# EAGLE schematic Gen7AdapterBoard (EAGLE 6.3)
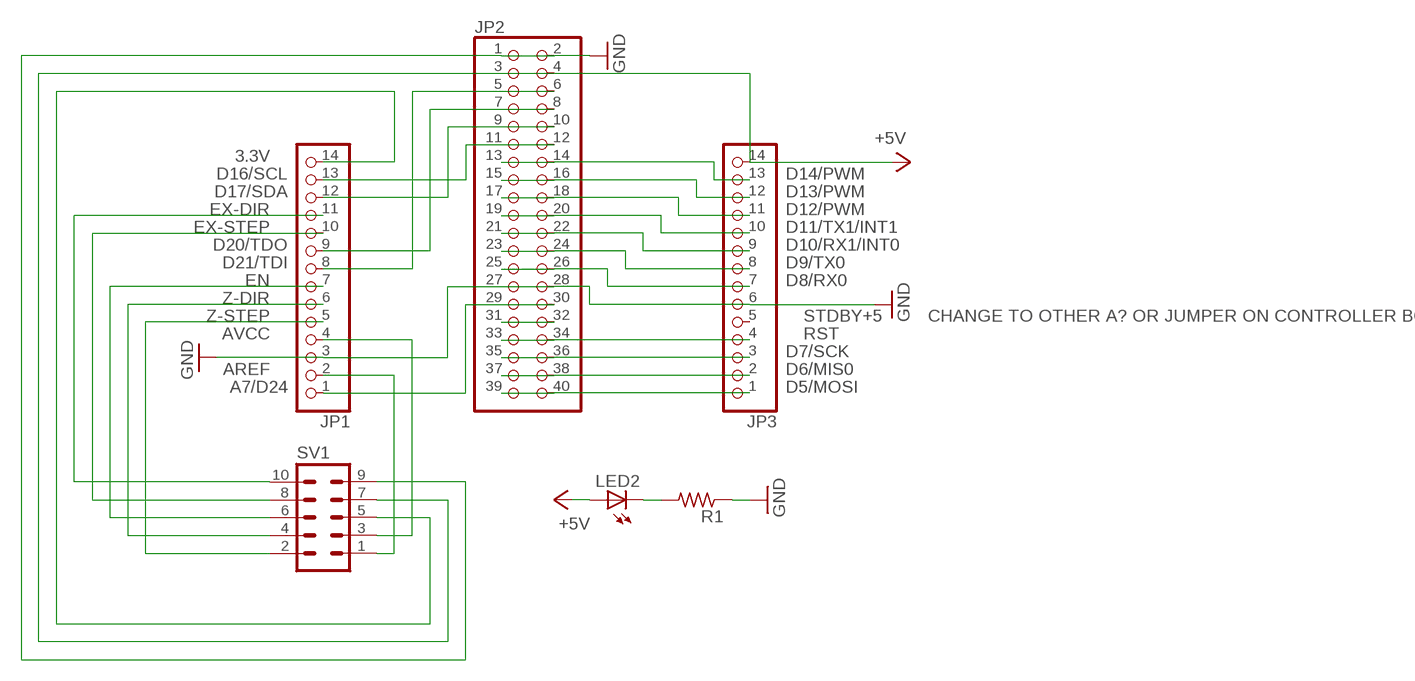
[diagram p0: schematic, sheet 1]

## Parts
JP1  PINHD-1X14  [1X14]
JP2  PINHD-2X20  [2X20]
JP3  PINHD-1X14  [1X14]
LED2  LED5MM  [LED5MM]
R1  R-US_0207/10  [0207/10]
SV1  MA05-2  [MA05-2]

## Nets
+5V: JP2.3 JP2.4 JP3.14 LED2.A SV1.7
GND: JP1.3 JP2.1 JP2.2 JP2.27 JP2.28 JP3.6 R1.1 SV1.9
N$1: LED2.K(C) R1.2
N$2: JP1.7 SV1.6
N$3: JP1.14 SV1.5
N$4: JP1.8 JP2.5 JP2.6
N$5: JP1.9 JP2.7 JP2.8
N$8: JP2.13 JP2.14 JP3.13
N$9: JP2.15 JP2.16 JP3.12
N$10: JP2.17 JP2.18 JP3.11
N$11: JP2.19 JP2.20 JP3.10
N$12: JP2.21 JP2.22 JP3.9
N$13: JP2.23 JP2.24 JP3.8
N$14: JP2.25 JP2.26 JP3.7
N$15: JP1.11 SV1.10
N$16: JP1.1 JP2.29 JP2.30
N$17: JP2.31 JP2.32
N$18: JP2.33 JP2.34 JP3.4
N$19: JP2.35 JP2.36 JP3.3
N$20: JP2.37 JP2.38 JP3.2
N$21: JP2.39 JP2.40 JP3.1
N$22: JP1.10 SV1.8
N$23: JP1.6 SV1.4
N$24: JP1.5 SV1.2
N$25: JP1.2 SV1.1
N$27: JP1.4 SV1.3
N$28: JP1.12 JP2.9 JP2.10
N$29: JP1.13 JP2.11 JP2.12
Unconnected: JP3.5

## Notes on the sheet
- 3.3V
- D16/SCL | D14/PWM
- D17/SDA | D13/PWM
- EX-DIR | D12/PWM
- EX-STEP | D11/TX1/INT1
- D20/TDO | D10/RX1/INT0
- D21/TDI | D9/TX0
- EN | D8/RX0
- Z-DIR
- Z-STEP | STDBY+5 | CHANGE TO OTHER A? OR JUMPER ON CONTROLLER BOARD
- AVCC | RST
- D7/SCK
- AREF | D6/MIS0
- A7/D24 | D5/MOSI

## Library data of the parts
JP1 JP3 = pinhead:PINHD-1X14: PIN HEADER
JP2 = pinhead:PINHD-2X20: PIN HEADER
LED2 = led:LED: LED OSRAM: - CHIPLED LG R971, LG N971, LY N971, LG Q971, LY Q971, LO R971, LY R971 LH N974, LH R974 LS Q976, LO Q976, LY Q976 LO Q996 - Hyper CHIPLED LW Q18S LB Q993, LB Q99A, LB R99A - SideLED LS A670, LO A670, LY A670, LG A670, LP A670 LB A673, LV A673, LT A673, LW A673 LH A674 LY A675 LS A676, LA A676, LO A676, LY A676, LW A676 LS A679, LY A679, LG A679 - Hyper Micro SIDELED® LS Y876, LA Y876, LO Y876, LY Y876 LT Y87S - SmartLED LW L88C, LW L88S LB L89C, LB L89S, LG L890 LS L89K, LO L89K, LY L89K LS L896, LA L896, LO L896, LY L896 - TOPLED LS T670, LO T670, LY T670, LG T670, LP T670 LSG T670, LSP T670, LSY T670, LOP T670, LYG T670 LG T671, LOG T671, LSG T671 LB T673, LV T673, LT T673, LW T673 LH T674 LS T676, LA T676, LO T676, LY T676, LB T676, LH T676, LSB T676, LW T676 LB T67C, LV T67C, LT T67C, LS T67K, LO T67K, LY T67K, LW E67C LS E67B, LA E67B, LO E67B, LY E67B, LB E67C, LV E67C, LT E67C LW T67C LS T679, LY T679, LG T679 LS T770, LO T770, LY T770, LG T770, LP T770 LB T773, LV T773, LT T773, LW T773 LH T774 LS E675, LA E675, LY E675, LS T675 LS T776, LA T776, LO T776, LY T776, LB T776 LHGB T686 LT T68C, LB T68C - Hyper Mini TOPLED® LB M676 - Mini TOPLED Santana® LG M470 LS M47K, LO M47K, LY M47K Source: http://www.osram.convergy.de LUXEON: - LUMILED® LXK2-PW12-R00, LXK2-PW12-S00, LXK2-PW14-U00, LXK2-PW14-V00 LXK2-PM12-R00, LXK2-PM12-S00, LXK2-PM14-U00 LXK2-PE12-Q00, LXK2-PE12-R00, LXK2-PE12-S00, LXK2-PE14-T00, LXK2-PE14-U00 LXK2-PB12-K00, LXK2-PB12-L00, LXK2-PB12-M00, LXK2-PB14-N00, LXK2-PB14-P00, LXK2-PB14-Q00 LXK2-PR12-L00, LXK2-PR12-M00, LXK2-PR14-Q00, LXK2-PR14-R00 LXK2-PD12-Q00, LXK2-PD12-R00, LXK2-PD12-S00 LXK2-PH12-R00, LXK2-PH12-S00 LXK2-PL12-P00, LXK2-PL12-Q00, LXK2-PL12-R00 Source: www.luxeon.com KINGBRIGHT: KA-3528ASYC Source: www.kingbright.com
R1 = resistor:R-US_: RESISTOR, American symbol
SV1 = con-lstb:MA05-2: PIN HEADER; OC_FARNELL: unknown; OC_NEWARK: unknown